# EAGLE schematic deneme3 (EAGLE 9.6.2)
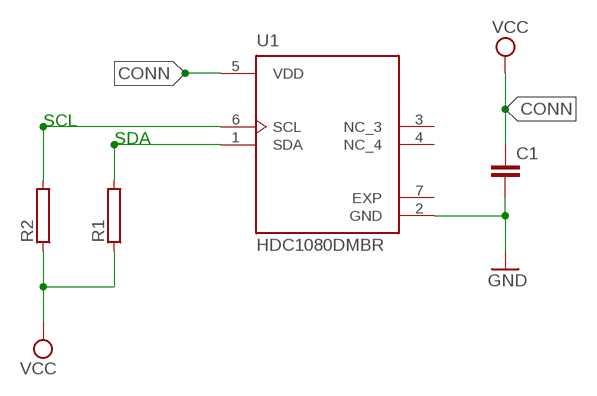
[diagram p0: schematic, sheet 1]

## Parts
C1  C2,5-3  [C2.5-3]
R1  RMG100-V  [TO-247-2V]
R2  RMG100-V  [TO-247-2V]
U1  HDC1080DMBR  [SON100P300X300X80-7N]

## Nets
CONN: C1.1 U1.5(VDD) ; supply symbol labelled VCC
GND: C1.2 U1.2(GND)
N$1: R1.2 U1.1(SDA)
N$3: R2.2 U1.6(SCL)
VCC: R1.1 R2.1
Unconnected: U1.3(NC_3) U1.4(NC_4) U1.7(EXP)

## Notes on the sheet
- SCL
- SDA

## Library data of the parts
C1 = capacitor-wima:C: CAPACITOR naming: grid - package width
R1 R2 = resistor-power:RMG100: TO-247 Power Resistor - RMG 100 Series Source: www.token.com.tw .. power-resistor-rmg100pdf; OC_FARNELL: unknown; OC_NEWARK: unknown
U1 = HDC1080DMBR:HDC1080DMBR: low-power digital humidity and temperature sensor 6-WSON -40 to 125 Check prices <https://pricing.snapeda.com/parts/HDC1080DMBR/Texas%20Instruments/view-part?ref=eda>; AVAILABILITY: Warning; DESCRIPTION: &plusmn;2% low-power digital humidity and temperature sensor 6-WSON -40 to 125; MF: Texas Instruments; MP: HDC1080DMBR; PACKAGE: WSON-6 Texas Instruments; PRICE: None; PURCHASE-URL: https://pricing.snapeda.com/search/part/HDC1080DMBR/?ref=eda